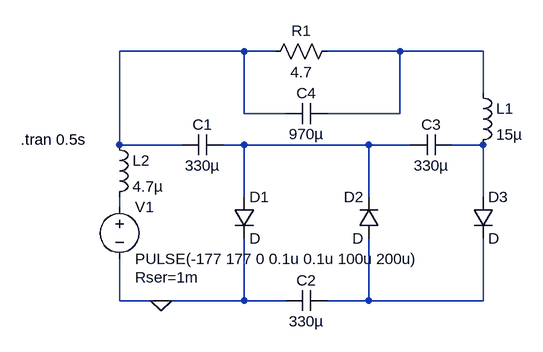
[diagram p0: schematic Voltage_Multiplier.asc]
Voltage_Multiplier.asc, the LTspice schematic file:
Version 4
SHEET 1 880 680
WIRE 272 -128 80 -128
WIRE 320 -128 272 -128
WIRE 512 -128 400 -128
WIRE 640 -128 512 -128
WIRE 640 -64 640 -128
WIRE 272 -32 272 -128
WIRE 336 -32 272 -32
WIRE 512 -32 512 -128
WIRE 512 -32 400 -32
WIRE 80 16 80 -128
WIRE 176 16 80 16
WIRE 272 16 240 16
WIRE 464 16 272 16
WIRE 528 16 464 16
WIRE 640 16 592 16
WIRE 272 96 272 16
WIRE 464 96 464 16
WIRE 640 96 640 16
WIRE 80 112 80 96
WIRE 80 256 80 192
WIRE 144 256 80 256
WIRE 272 256 272 160
WIRE 272 256 144 256
WIRE 336 256 272 256
WIRE 464 256 464 160
WIRE 464 256 400 256
WIRE 640 256 640 160
WIRE 640 256 464 256
FLAG 144 256 0
SYMBOL voltage 80 96 R0
WINDOW 123 0 0 Left 0
WINDOW 39 24 124 Left 2
SYMATTR SpiceLine Rser=1m
SYMATTR InstName V1
SYMATTR Value PULSE(-177 177 0 0.1u 0.1u 100u 200u)
SYMBOL cap 240 0 R90
WINDOW 0 0 32 VBottom 2
WINDOW 3 32 32 VTop 2
SYMATTR InstName C1
SYMATTR Value 330µ
SYMATTR SpiceLine Rser=1.9m
SYMBOL cap 400 240 R90
WINDOW 0 0 32 VBottom 2
WINDOW 3 32 32 VTop 2
SYMATTR InstName C2
SYMATTR Value 330µ
SYMATTR SpiceLine Rser=1.9m
SYMBOL cap 592 0 R90
WINDOW 0 0 32 VBottom 2
WINDOW 3 32 32 VTop 2
SYMATTR InstName C3
SYMATTR Value 330µ
SYMATTR SpiceLine Rser=1.9m
SYMBOL diode 256 96 R0
SYMATTR InstName D1
SYMBOL diode 480 160 R180
WINDOW 0 24 64 Left 2
WINDOW 3 24 0 Left 2
SYMATTR InstName D2
SYMBOL diode 624 96 R0
SYMATTR InstName D3
SYMBOL res 416 -144 R90
WINDOW 0 0 56 VBottom 2
WINDOW 3 32 56 VTop 2
SYMATTR InstName R1
SYMATTR Value 4.7
SYMBOL ind 624 -80 R0
SYMATTR InstName L1
SYMATTR Value 15µ
SYMATTR SpiceLine Rser=0.1m
SYMBOL cap 400 -48 R90
WINDOW 0 0 32 VBottom 2
WINDOW 3 32 32 VTop 2
SYMATTR InstName C4
SYMATTR Value 970µ
SYMATTR SpiceLine Rser=2m
SYMBOL ind 64 0 R0
SYMATTR InstName L2
SYMATTR Value 4.7µ
SYMATTR SpiceLine Rser=0.1m
TEXT -72 8 Left 2 !.tran 0.5s

The netlist it stands for:
* Voltage_Multiplier.asc
V1 N005 0 PULSE(-177 177 0 0.1u 0.1u 100u 200u) Rser=1m
C1 N003 N001 330µ Rser=1.9m
C2 N006 0 330µ Rser=1.9m
C3 N004 N003 330µ Rser=1.9m
D1 N003 0 D
D2 N006 N003 D
D3 N004 N006 D
R1 N002 N001 4.7
L1 N002 N004 15µ Rser=0.1m
C4 N002 N001 970µ Rser=2m
L2 N001 N005 4.7µ Rser=0.1m
.model D D
.lib standard.dio
.tran 0.5s
.backanno
.end